# EAGLE design pumpbox-v4 (EAGLE 7.5.0)
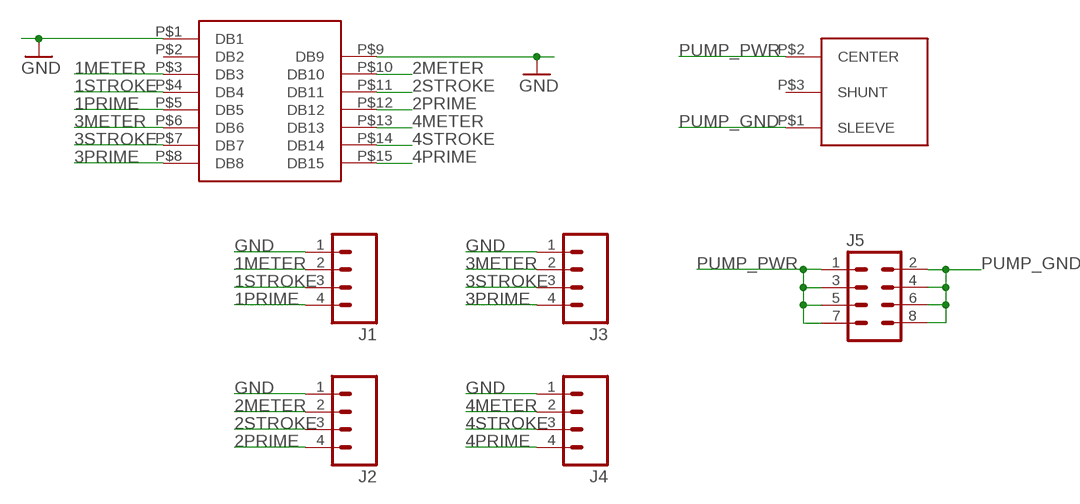
[diagram p0: schematic, sheet 1]

## Parts
J1  M04PTH  [1X04]
J2  M04PTH  [1X04]
J3  M04PTH  [1X04]
J4  M04PTH  [1X04]
J5  M04X2  [2X4]
U$1  DB15  [DB15]
U$2  RAPC10P  [RAPC10P]

## Nets
1METER: J1.2 U$1.P$3(DB3)
1PRIME: J1.4 U$1.P$5(DB5)
1STROKE: J1.3 U$1.P$4(DB4)
2METER: J2.2 U$1.P$10(DB10)
2PRIME: J2.4 U$1.P$12(DB12)
2STROKE: J2.3 U$1.P$11(DB11)
3METER: J3.2 U$1.P$6(DB6)
3PRIME: J3.4 U$1.P$8(DB8)
3STROKE: J3.3 U$1.P$7(DB7)
4METER: J4.2 U$1.P$13(DB13)
4PRIME: J4.4 U$1.P$15(DB15)
4STROKE: J4.3 U$1.P$14(DB14)
GND: J1.1 J2.1 J3.1 J4.1 U$1.P$1(DB1) U$1.P$9(DB9)
PUMP_GND: J5.2 J5.4 J5.6 J5.8 U$2.P$1(SLEEVE)
PUMP_PWR: J5.1 J5.3 J5.5 J5.7 U$2.P$2(CENTER)
Unconnected: U$1.P$2(DB2) U$2.P$3(SHUNT)

## Library data of the parts
J1-J4 = SparkFun-Connectors:M04: Header 4 Standard 4-pin 0.1" header. Use with straight break away headers (SKU : PRT-00116), right angle break away headers (PRT-00553), swiss pins (PRT-00743), machine pins (PRT-00117), and female headers (PRT-00115). Molex polarized connector foot print use with SKU : PRT-08231 with associated crimp pins and housings. 1MM SMD Version SKU: PRT-10208; PROD_ID: CONN-09696
J5 = SparkFun-Connectors:M04X2: .1" header, two rows of four.
U$1 = kimth:DB15: DIGIKEY A105027-ND
U$2 = kimth:RAPC10P: Switchcraft RAPC10P DIGIKEY SC1941-ND

## Board
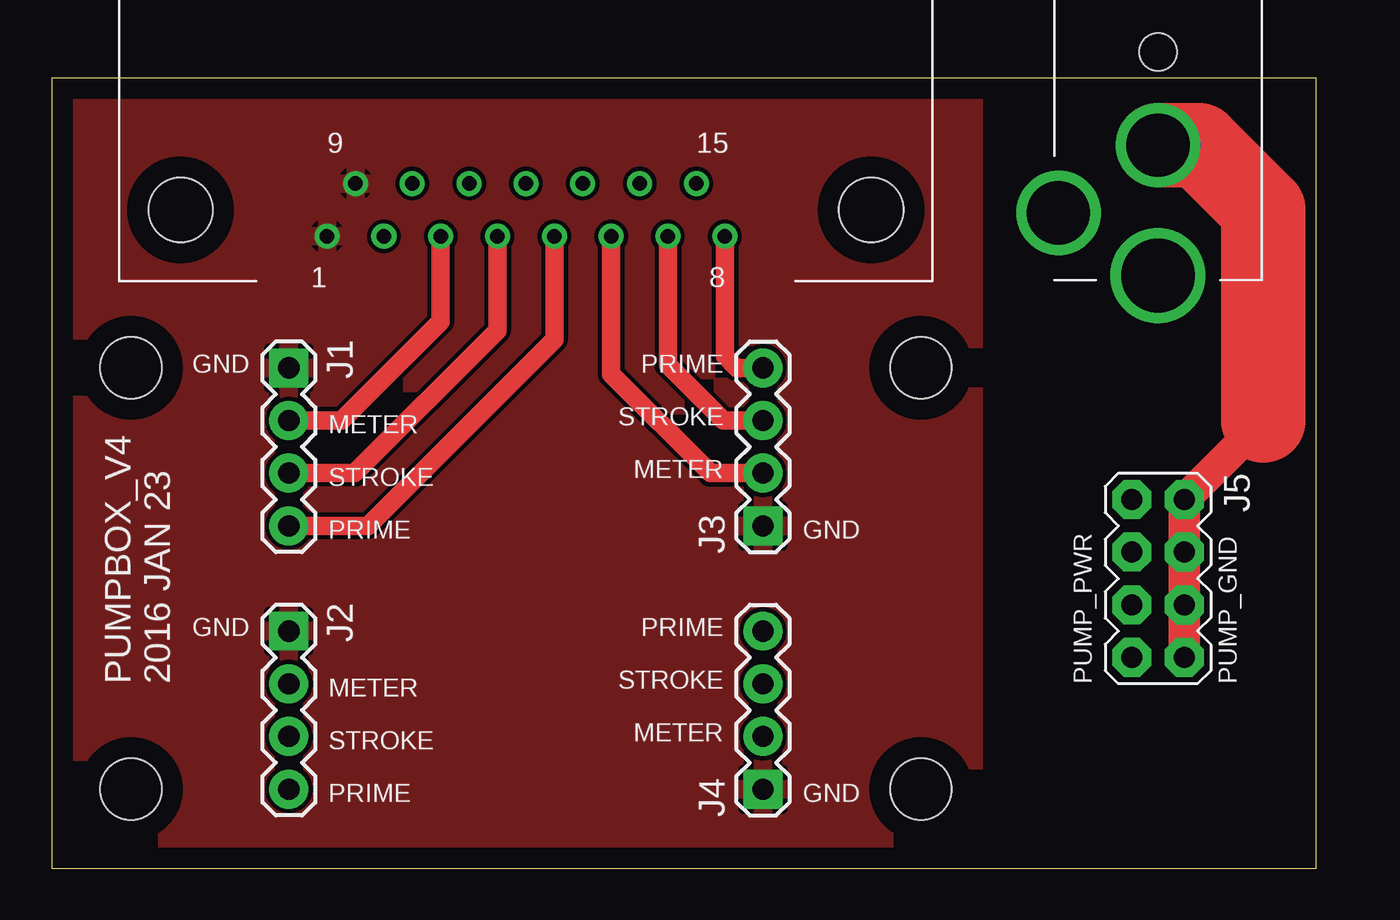
[diagram p1: board, top side]
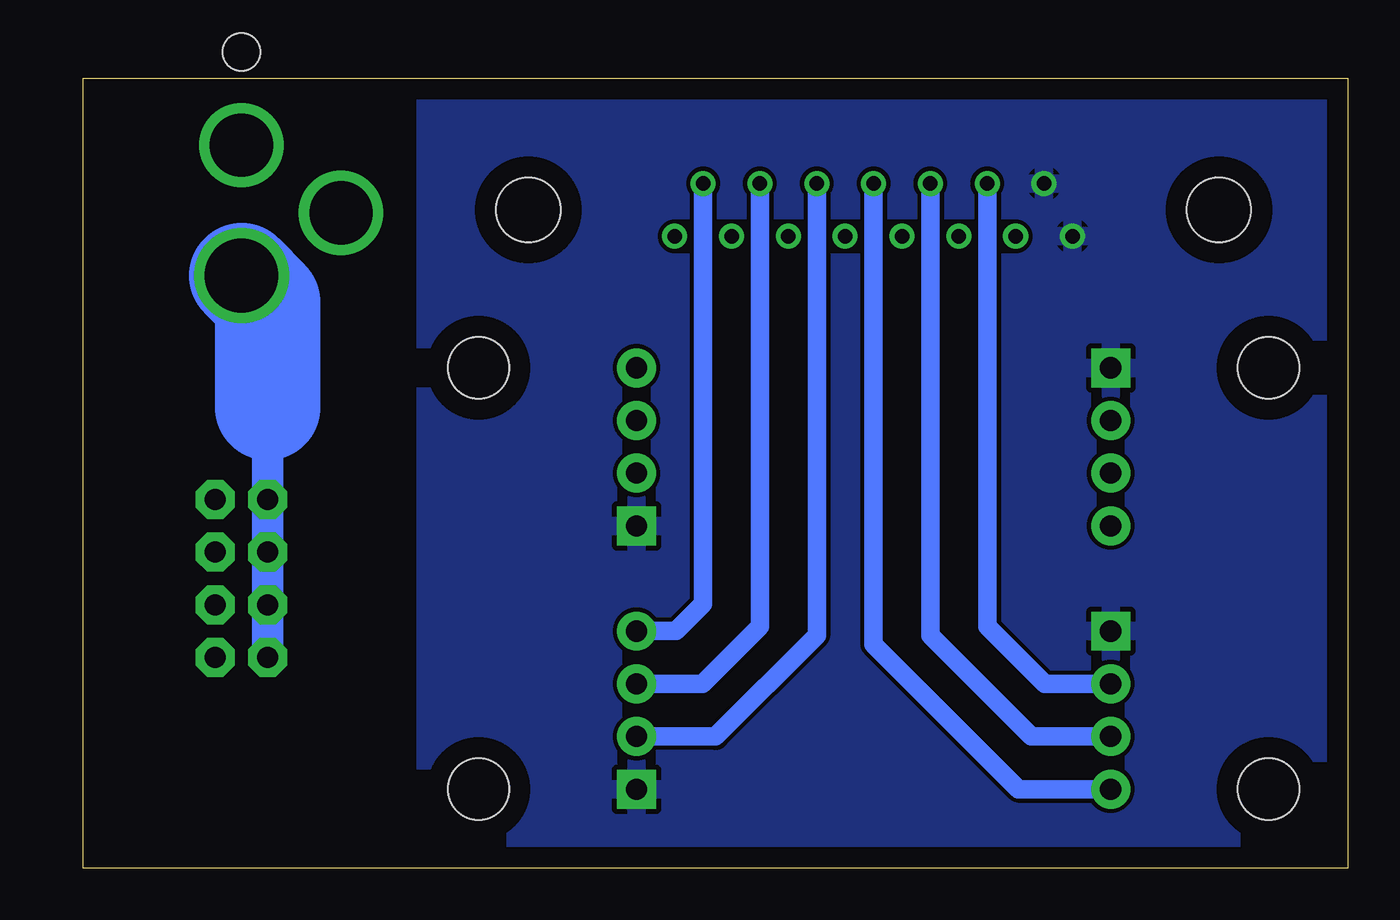
[diagram p2: board, bottom side, seen from below]

Size 60.96 x 38.1 mm. Coordinates in mm from the lower left corner, seen from the top.
Outline: 0,0 60.96,0 60.96,38.1 0,38.1 0,0
Copper layers (1*16): Top 0.035mm / dielectric 1.5mm / Bottom 0.035mm
Design rules "default": minimum track width 10mil, minimum drill 24mil, track to track 8mil, track to pad 8mil, pad to pad 8mil, via to via 8mil, smd to smd 8mil, copper to edge 40mil, drill to drill 8mil, minimum pad ring 10mil, minimum via ring 8mil, stop-mask expansion 4mil, vias tented up to drill 0mil, thermal gap 10mil
Holes 2.95 mm at 3.81,3.81 41.91,3.81 3.81,24.13 41.91,24.13

### Footprints (pad centres in the part's own frame; a part is rotated, then mirrored left to right if it is on the bottom)
1X04 = drill 1.016 pad 1.88 square: 1 0,0 | drill 1.016 pad 1.88: 2 2.54,0; 3 5.08,0; 4 7.62,0
2X4 = drill 1.016 pad 1.88 octagon: 1 -3.81,-1.27; 2 -3.81,1.27; 3 -1.27,-1.27; 4 -1.27,1.27; 5 1.27,-1.27; 6 1.27,1.27; 7 3.81,-1.27; 8 3.81,1.27
DB15 = drill 0.7: P$1 9.59,1.27; P$2 6.85,1.27; P$3 4.11,1.27; P$4 1.37,1.27; P$5 -1.37,1.27; P$6 -4.11,1.27; P$7 -6.85,1.27; P$8 -9.59,1.27; P$9 8.22,-1.27; P$10 5.48,-1.27; P$11 2.74,-1.27; P$12 0,-1.27; P$13 -2.74,-1.27; P$14 -5.48,-1.27; P$15 -8.22,-1.27 | hole 3.1: 16.65,0; -16.65,0
RAPC10P = drill 3.05: P$1 4.5,0; P$3 7.77,-4.8 | drill 3.56: P$2 10.79,0 | hole 1.8: 0,0

### Placement (x,y rotation side)
J1  11.43,24.13 270 top
J2  11.43,11.43 270 top
J3  34.29,16.51 90 top
J4  34.29,3.81 90 top
J5  53.34,13.97 270 top
U$1  22.86,31.75 180 top
U$2  53.34,39.37 270 top

### Tracks (layer width: path | path; a pad name or v marks a point on that pad's centre or on a via)
1METER
  Top 0.889: U$1.P$3 18.75,26.37 13.97,21.59 J1.2
1PRIME
  Top 0.889: U$1.P$5 24.23,25.5 15.24,16.51 J1.4
1STROKE
  Top 0.889: U$1.P$4 21.49,25.93 14.61,19.05 J1.3
2METER
  Bottom 0.889: U$1.P$10 17.38,11.66 14.61,8.89 J2.2
2PRIME
  Bottom 0.889: U$1.P$12 22.86,10.79 15.88,3.81 J2.4
2STROKE
  Bottom 0.889: U$1.P$11 20.12,11.23 15.24,6.35 J2.3
3METER
  Top 0.889: U$1.P$6 26.97,23.83 31.75,19.05 J3.2
3PRIME
  Top 0.889: U$1.P$8 32.45,24.7 33.02,24.13 J3.4
3STROKE
  Top 0.889: U$1.P$7 29.71,24.27 32.38,21.59 J3.3
4METER
  Bottom 0.889: U$1.P$13 25.6,11.23 30.48,6.35 J4.2
4PRIME
  Bottom 0.889: U$1.P$15 31.08,12.73 32.38,11.43 J4.4
4STROKE
  Bottom 0.889: U$1.P$14 28.34,11.66 31.11,8.89 J4.3
GND
  pour Top: 0,38.1 44.45,38.1 44.45,0 0,0
  pour Bottom: 0,38.1 44.45,38.1 44.45,0 0,0
PUMP_GND
  Top 1.524: 58.42,21.59 J5.2 J5.4 J5.6 J5.8
  Top 4.064: U$2.P$1 55.3,34.87 58.42,31.75 58.42,21.59
PUMP_PWR
  Bottom 1.524: 52.07,22.23 J5.1 J5.3 J5.5 J5.7
  Bottom 5.08: U$2.P$2 52.07,27.31 52.07,22.23

### Text on the board
tNames: GND | PRIME | STROKE | METER | METER | STROKE | PRIME | GND | GND | PRIME | STROKE | PUMPBOX_V4 / 2016 JAN 23 | PUMP_PWR | PUMP_GND | METER | METER | STROKE | PRIME | GND